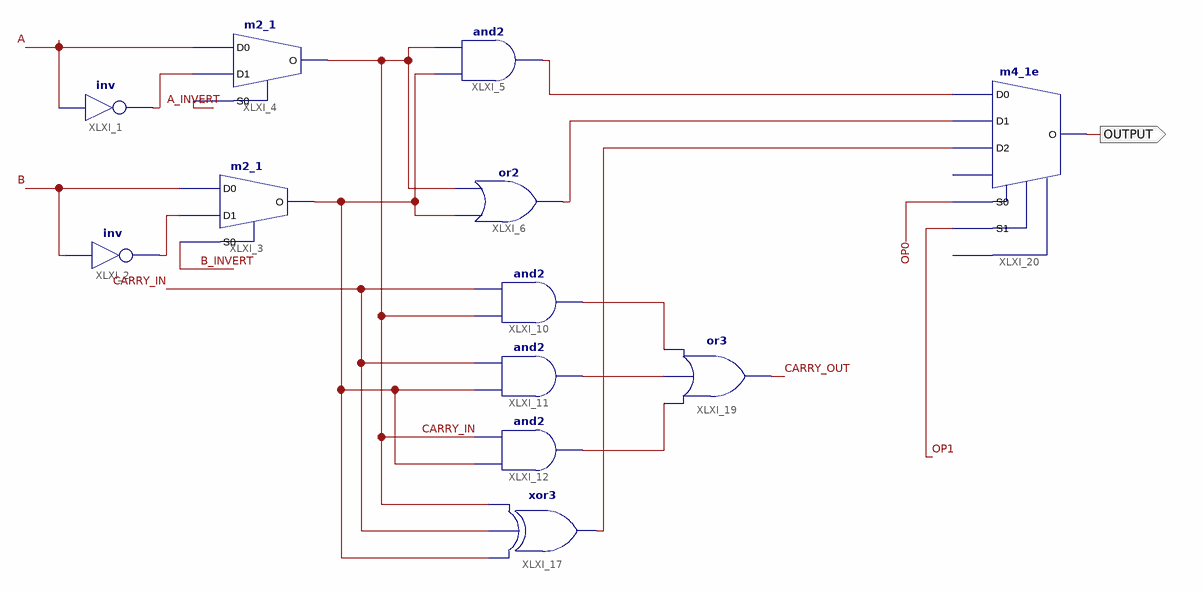
[diagram p0: schematic sheet 1]
// Xilinx ISE schematic alu_schematic.sch (artix7) as structural Verilog: 12 symbols, 1 ports
module alu_schematic (
  output OUTPUT
);

  wire A, A_INVERT, B, B_INVERT, CARRY_IN, CARRY_OUT, OP0, OP1, XLXN_5, XLXN_6, XLXN_33, XLXN_40, XLXN_41,
       XLXN_42, XLXN_44, XLXN_45, XLXN_46;

  not XLXI_1 (XLXN_5, A);
  not XLXI_2 (XLXN_6, B);
  m2_1 XLXI_3 (.D0(B), .D1(XLXN_6), .S0(B_INVERT), .O(XLXN_33));
  m2_1 XLXI_4 (.D0(A), .D1(XLXN_5), .S0(A_INVERT), .O(CARRY_IN));
  and XLXI_5 (XLXN_44, XLXN_33, CARRY_IN);
  or XLXI_6 (XLXN_45, XLXN_33, CARRY_IN);
  and XLXI_10 (XLXN_40, CARRY_IN, CARRY_IN);
  and XLXI_11 (XLXN_41, XLXN_33, CARRY_IN);
  and XLXI_12 (XLXN_42, XLXN_33, CARRY_IN);
  xor XLXI_17 (XLXN_46, XLXN_33, CARRY_IN, CARRY_IN);
  or XLXI_19 (CARRY_OUT, XLXN_42, XLXN_41, XLXN_40);
  m4_1e XLXI_20 (.D0(XLXN_44), .D1(XLXN_45), .D2(XLXN_46), .S0(OP0), .S1(OP1), .O(OUTPUT));  // open: D3, E
endmodule
